# EAGLE design ethernet_switch (EAGLE 6.3)
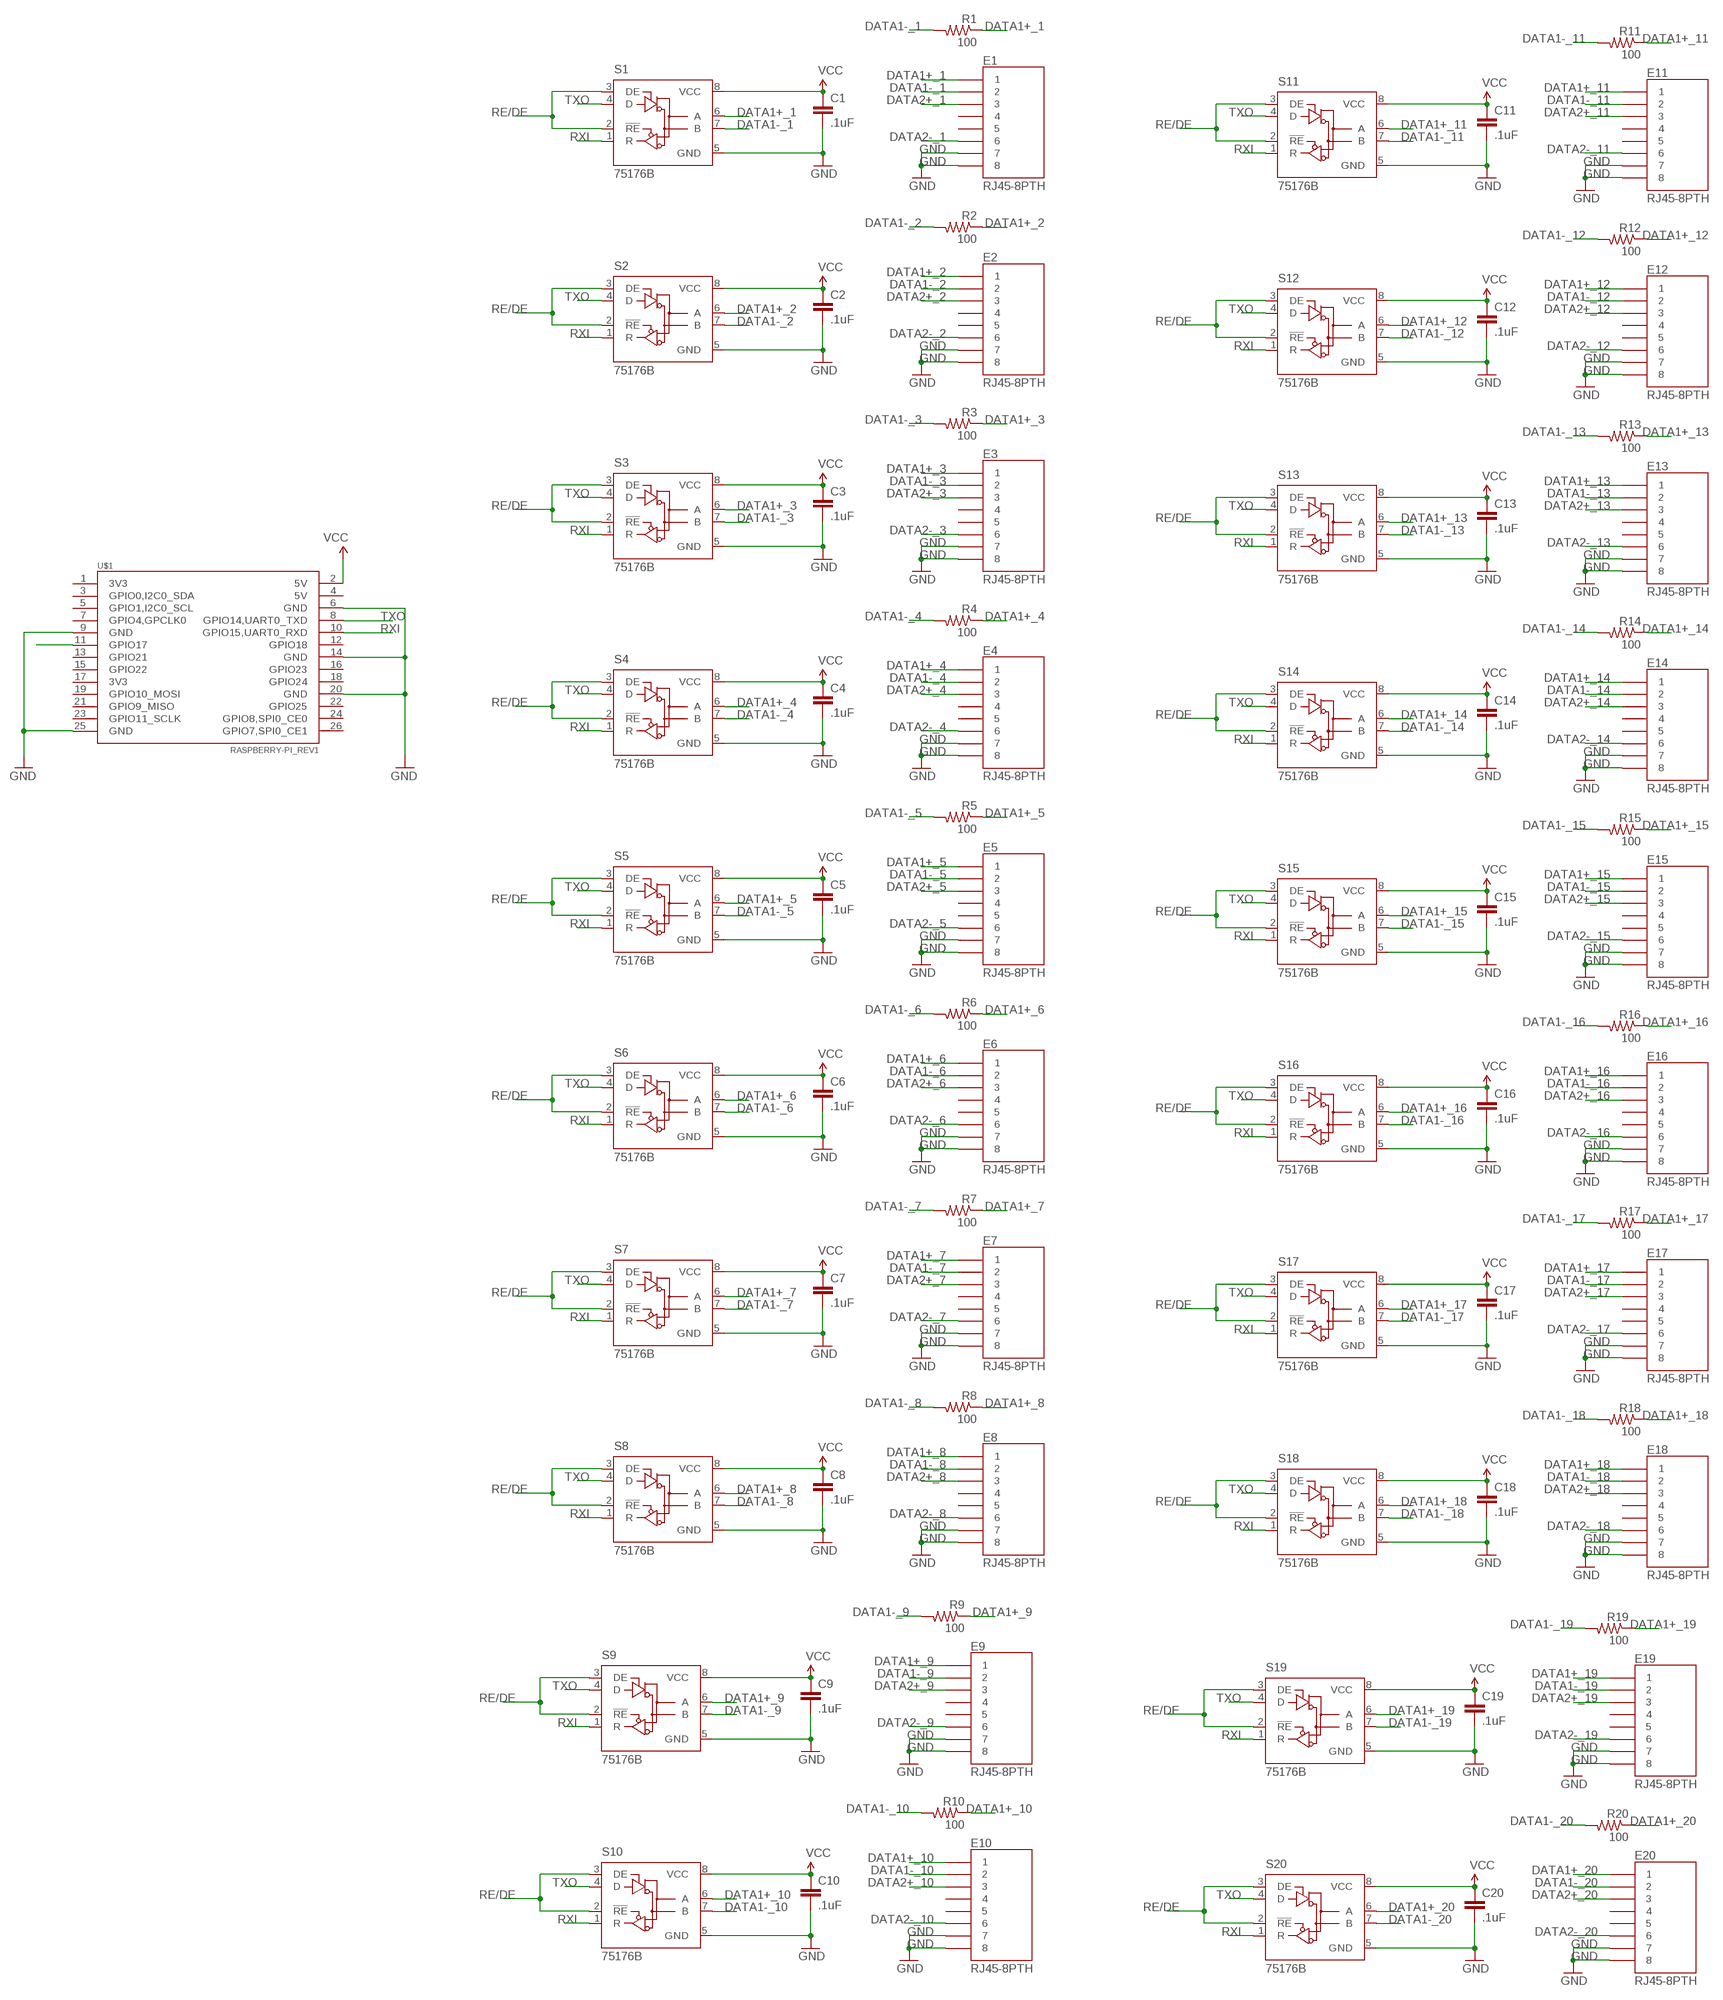
[diagram p0: schematic, sheet 1]

## Parts
C1  .1uF  CAP0402-CAP  [0402-CAP]
C2  .1uF  CAP0402-CAP  [0402-CAP]
C3  .1uF  CAP0402-CAP  [0402-CAP]
C4  .1uF  CAP0402-CAP  [0402-CAP]
C5  .1uF  CAP0402-CAP  [0402-CAP]
C6  .1uF  CAP0402-CAP  [0402-CAP]
C7  .1uF  CAP0402-CAP  [0402-CAP]
C8  .1uF  CAP0402-CAP  [0402-CAP]
C9  .1uF  CAP0402-CAP  [0402-CAP]
C10  .1uF  CAP0402-CAP  [0402-CAP]
C11  .1uF  CAP0402-CAP  [0402-CAP]
C12  .1uF  CAP0402-CAP  [0402-CAP]
C13  .1uF  CAP0402-CAP  [0402-CAP]
C14  .1uF  CAP0402-CAP  [0402-CAP]
C15  .1uF  CAP0402-CAP  [0402-CAP]
C16  .1uF  CAP0402-CAP  [0402-CAP]
C17  .1uF  CAP0402-CAP  [0402-CAP]
C18  .1uF  CAP0402-CAP  [0402-CAP]
C19  .1uF  CAP0402-CAP  [0402-CAP]
C20  .1uF  CAP0402-CAP  [0402-CAP]
E1  RJ45-8PTH  [RJ45-8]
E2  RJ45-8PTH  [RJ45-8]
E3  RJ45-8PTH  [RJ45-8]
E4  RJ45-8PTH  [RJ45-8]
E5  RJ45-8PTH  [RJ45-8]
E6  RJ45-8PTH  [RJ45-8]
E7  RJ45-8PTH  [RJ45-8]
E8  RJ45-8PTH  [RJ45-8]
E9  RJ45-8PTH  [RJ45-8]
E10  RJ45-8PTH  [RJ45-8]
E11  RJ45-8PTH  [RJ45-8]
E12  RJ45-8PTH  [RJ45-8]
E13  RJ45-8PTH  [RJ45-8]
E14  RJ45-8PTH  [RJ45-8]
E15  RJ45-8PTH  [RJ45-8]
E16  RJ45-8PTH  [RJ45-8]
E17  RJ45-8PTH  [RJ45-8]
E18  RJ45-8PTH  [RJ45-8]
E19  RJ45-8PTH  [RJ45-8]
E20  RJ45-8PTH  [RJ45-8]
R1  100  RESISTOR1206  [1206]
R2  100  RESISTOR1206  [1206]
R3  100  RESISTOR1206  [1206]
R4  100  RESISTOR1206  [1206]
R5  100  RESISTOR1206  [1206]
R6  100  RESISTOR1206  [1206]
R7  100  RESISTOR1206  [1206]
R8  100  RESISTOR1206  [1206]
R9  100  RESISTOR1206  [1206]
R10  100  RESISTOR1206  [1206]
R11  100  RESISTOR1206  [1206]
R12  100  RESISTOR1206  [1206]
R13  100  RESISTOR1206  [1206]
R14  100  RESISTOR1206  [1206]
R15  100  RESISTOR1206  [1206]
R16  100  RESISTOR1206  [1206]
R17  100  RESISTOR1206  [1206]
R18  100  RESISTOR1206  [1206]
R19  100  RESISTOR1206  [1206]
R20  100  RESISTOR1206  [1206]
S1  75176B  [D_R-PDSO-G8]
S2  75176B  [D_R-PDSO-G8]
S3  75176B  [D_R-PDSO-G8]
S4  75176B  [D_R-PDSO-G8]
S5  75176B  [D_R-PDSO-G8]
S6  75176B  [D_R-PDSO-G8]
S7  75176B  [D_R-PDSO-G8]
S8  75176B  [D_R-PDSO-G8]
S9  75176B  [D_R-PDSO-G8]
S10  75176B  [D_R-PDSO-G8]
S11  75176B  [D_R-PDSO-G8]
S12  75176B  [D_R-PDSO-G8]
S13  75176B  [D_R-PDSO-G8]
S14  75176B  [D_R-PDSO-G8]
S15  75176B  [D_R-PDSO-G8]
S16  75176B  [D_R-PDSO-G8]
S17  75176B  [D_R-PDSO-G8]
S18  75176B  [D_R-PDSO-G8]
S19  75176B  [D_R-PDSO-G8]
S20  75176B  [D_R-PDSO-G8]
U$1  RASPBERRY-PI_REV1  [RASPBERRY-PI_REV1]

## Nets
DATA1+_1: E1.1 R1.1 S1.6(A)
DATA1+_2: E2.1 R2.1 S2.6(A)
DATA1+_3: E3.1 R3.1 S3.6(A)
DATA1+_4: E4.1 R4.1 S4.6(A)
DATA1+_5: E5.1 R5.1 S5.6(A)
DATA1+_6: E6.1 R6.1 S6.6(A)
DATA1+_7: E7.1 R7.1 S7.6(A)
DATA1+_8: E8.1 R8.1 S8.6(A)
DATA1+_9: E9.1 R9.1 S9.6(A)
DATA1+_10: E10.1 R10.1 S10.6(A)
DATA1+_11: E11.1 R11.1 S11.6(A)
DATA1+_12: E12.1 R12.1 S12.6(A)
DATA1+_13: E13.1 R13.1 S13.6(A)
DATA1+_14: E14.1 R14.1 S14.6(A)
DATA1+_15: E15.1 R15.1 S15.6(A)
DATA1+_16: E16.1 R16.1 S16.6(A)
DATA1+_17: E17.1 R17.1 S17.6(A)
DATA1+_18: E18.1 R18.1 S18.6(A)
DATA1+_19: E19.1 R19.1 S19.6(A)
DATA1+_20: E20.1 R20.1 S20.6(A)
DATA1-_1: E1.2 R1.2 S1.7(B)
DATA1-_2: E2.2 R2.2 S2.7(B)
DATA1-_3: E3.2 R3.2 S3.7(B)
DATA1-_4: E4.2 R4.2 S4.7(B)
DATA1-_5: E5.2 R5.2 S5.7(B)
DATA1-_6: E6.2 R6.2 S6.7(B)
DATA1-_7: E7.2 R7.2 S7.7(B)
DATA1-_8: E8.2 R8.2 S8.7(B)
DATA1-_9: E9.2 R9.2 S9.7(B)
DATA1-_10: E10.2 R10.2 S10.7(B)
DATA1-_11: E11.2 R11.2 S11.7(B)
DATA1-_12: E12.2 R12.2 S12.7(B)
DATA1-_13: E13.2 R13.2 S13.7(B)
DATA1-_14: E14.2 R14.2 S14.7(B)
DATA1-_15: E15.2 R15.2 S15.7(B)
DATA1-_16: E16.2 R16.2 S16.7(B)
DATA1-_17: E17.2 R17.2 S17.7(B)
DATA1-_18: E18.2 R18.2 S18.7(B)
DATA1-_19: E19.2 R19.2 S19.7(B)
DATA1-_20: E20.2 R20.2 S20.7(B)
DATA2+_1: E1.3
DATA2+_2: E2.3
DATA2+_3: E3.3
DATA2+_4: E4.3
DATA2+_5: E5.3
DATA2+_6: E6.3
DATA2+_7: E7.3
DATA2+_8: E8.3
DATA2+_9: E9.3
DATA2+_10: E10.3
DATA2+_11: E11.3
DATA2+_12: E12.3
DATA2+_13: E13.3
DATA2+_14: E14.3
DATA2+_15: E15.3
DATA2+_16: E16.3
DATA2+_17: E17.3
DATA2+_18: E18.3
DATA2+_19: E19.3
DATA2+_20: E20.3
DATA2-_1: E1.6
DATA2-_2: E2.6
DATA2-_3: E3.6
DATA2-_4: E4.6
DATA2-_5: E5.6
DATA2-_6: E6.6
DATA2-_7: E7.6
DATA2-_8: E8.6
DATA2-_9: E9.6
DATA2-_10: E10.6
DATA2-_11: E11.6
DATA2-_12: E12.6
DATA2-_13: E13.6
DATA2-_14: E14.6
DATA2-_15: E15.6
DATA2-_16: E16.6
DATA2-_17: E17.6
DATA2-_18: E18.6
DATA2-_19: E19.6
DATA2-_20: E20.6
GND: C1.2 C2.2 C3.2 C4.2 C5.2 C6.2 C7.2 C8.2 C9.2 C10.2 C11.2 C12.2 C13.2 C14.2 C15.2 C16.2 C17.2 C18.2 C19.2 C20.2 E1.7 E1.8 E2.7 E2.8 E3.7 E3.8 E4.7 E4.8 E5.7 E5.8 E6.7 E6.8 E7.7 E7.8 E8.7 E8.8 E9.7 E9.8 E10.7 E10.8 E11.7 E11.8 E12.7 E12.8 E13.7 E13.8 E14.7 E14.8 E15.7 E15.8 E16.7 E16.8 E17.7 E17.8 E18.7 E18.8 E19.7 E19.8 E20.7 E20.8 S1.5(GND) S2.5(GND) S3.5(GND) S4.5(GND) S5.5(GND) S6.5(GND) S7.5(GND) S8.5(GND) S9.5(GND) S10.5(GND) S11.5(GND) S12.5(GND) S13.5(GND) S14.5(GND) S15.5(GND) S16.5(GND) S17.5(GND) S18.5(GND) S19.5(GND) S20.5(GND) U$1.6(GND) U$1.9(GND) U$1.14(GND) U$1.20(GND) U$1.25(GND)
RE/DE: S1.2(!RE) S1.3(DE) S2.2(!RE) S2.3(DE) S3.2(!RE) S3.3(DE) S4.2(!RE) S4.3(DE) S5.2(!RE) S5.3(DE) S6.2(!RE) S6.3(DE) S7.2(!RE) S7.3(DE) S8.2(!RE) S8.3(DE) S9.2(!RE) S9.3(DE) S10.2(!RE) S10.3(DE) S11.2(!RE) S11.3(DE) S12.2(!RE) S12.3(DE) S13.2(!RE) S13.3(DE) S14.2(!RE) S14.3(DE) S15.2(!RE) S15.3(DE) S16.2(!RE) S16.3(DE) S17.2(!RE) S17.3(DE) S18.2(!RE) S18.3(DE) S19.2(!RE) S19.3(DE) S20.2(!RE) S20.3(DE) U$1.11(GPIO17)
RXI: S1.1(R) S2.1(R) S3.1(R) S4.1(R) S5.1(R) S6.1(R) S7.1(R) S8.1(R) S9.1(R) S10.1(R) S11.1(R) S12.1(R) S13.1(R) S14.1(R) S15.1(R) S16.1(R) S17.1(R) S18.1(R) S19.1(R) S20.1(R) U$1.10(GPIO15,UART0_RXD)
TXO: S1.4(D) S2.4(D) S3.4(D) S4.4(D) S5.4(D) S6.4(D) S7.4(D) S8.4(D) S9.4(D) S10.4(D) S11.4(D) S12.4(D) S13.4(D) S14.4(D) S15.4(D) S16.4(D) S17.4(D) S18.4(D) S19.4(D) S20.4(D) U$1.8(GPIO14,UART0_TXD)
VCC: C1.1 C2.1 C3.1 C4.1 C5.1 C6.1 C7.1 C8.1 C9.1 C10.1 C11.1 C12.1 C13.1 C14.1 C15.1 C16.1 C17.1 C18.1 C19.1 C20.1 S1.8(VCC) S2.8(VCC) S3.8(VCC) S4.8(VCC) S5.8(VCC) S6.8(VCC) S7.8(VCC) S8.8(VCC) S9.8(VCC) S10.8(VCC) S11.8(VCC) S12.8(VCC) S13.8(VCC) S14.8(VCC) S15.8(VCC) S16.8(VCC) S17.8(VCC) S18.8(VCC) S19.8(VCC) S20.8(VCC) U$1.2(5V)
Unconnected: E1.4 E1.5 E2.4 E2.5 E3.4 E3.5 E4.4 E4.5 E5.4 E5.5 E6.4 E6.5 E7.4 E7.5 E8.4 E8.5 E9.4 E9.5 E10.4 E10.5 E11.4 E11.5 E12.4 E12.5 E13.4 E13.5 E14.4 E14.5 E15.4 E15.5 E16.4 E16.5 E17.4 E17.5 E18.4 E18.5 E19.4 E19.5 E20.4 E20.5 U$1.1(3V3) U$1.3(GPIO0,I2C0_SDA) U$1.4(5V) U$1.5(GPIO1,I2C0_SCL) U$1.7(GPIO4,GPCLK0) U$1.12(GPIO18) U$1.13(GPIO21) U$1.15(GPIO22) U$1.16(GPIO23) U$1.17(3V3) U$1.18(GPIO24) U$1.19(GPIO10_MOSI) U$1.21(GPIO9_MISO) U$1.22(GPIO25) U$1.23(GPIO11_SCLK) U$1.24(GPIO8,SPI0_CE0) U$1.26(GPIO7,SPI0_CE1)

## Library data of the parts
C1-C20 = SparkFun-Capacitors:CAP: Capacitor Standard 0603 ceramic capacitor, and 0.1" leaded capacitor.
E1-E20 = SparkFun-Connectors:RJ45-8: RJ45 Jack Simple RJ45, 8-pin connection - connector for common Cat5, Cat5e, and Cat6 Ethernet cables. Footprint not yet proven in production. Connector sku is PRT-00643; Breakout PCB sku is BOB-00716.
R1-R20 = SparkFun-Passives:RESISTOR: Resistor Basic schematic elements and footprints for 0603, 1206, and PTH resistors.
S1-S20 = 751xx:75176B: 75176B
U$1 = RaspberryPi:RASPBERRY-PI_REV1: Raspberry Pi Board <http://www.raspberrypi.org/> Jacques Lagnel V1.0 (beta) 2012 Mateusz Bawaj V1.1 (beta) 2012 Board dimension: Forum 3D model <http://www.raspberrypi.org/forum/general-discussion/mechanical-profile-3d-models?value=3d%20model&type=1&include=1&search=1&ret=all> The GPIO Connector (P1): http://elinux.org/RPi_Low-level_peripherals

## Net classes
1 vcc: width 0.254 mm

## Board
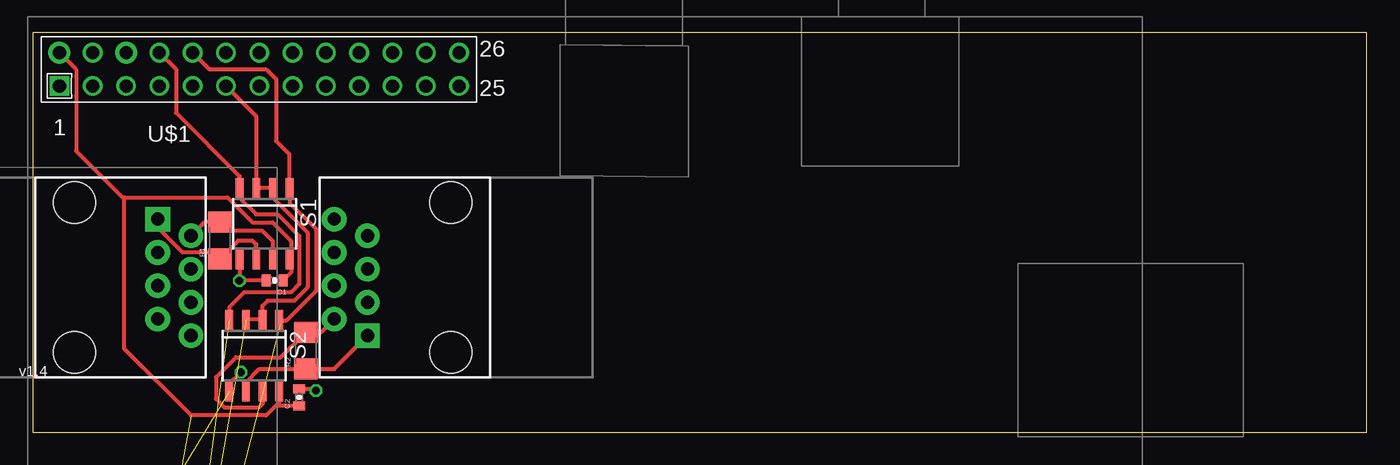
[diagram p1: board, top side]
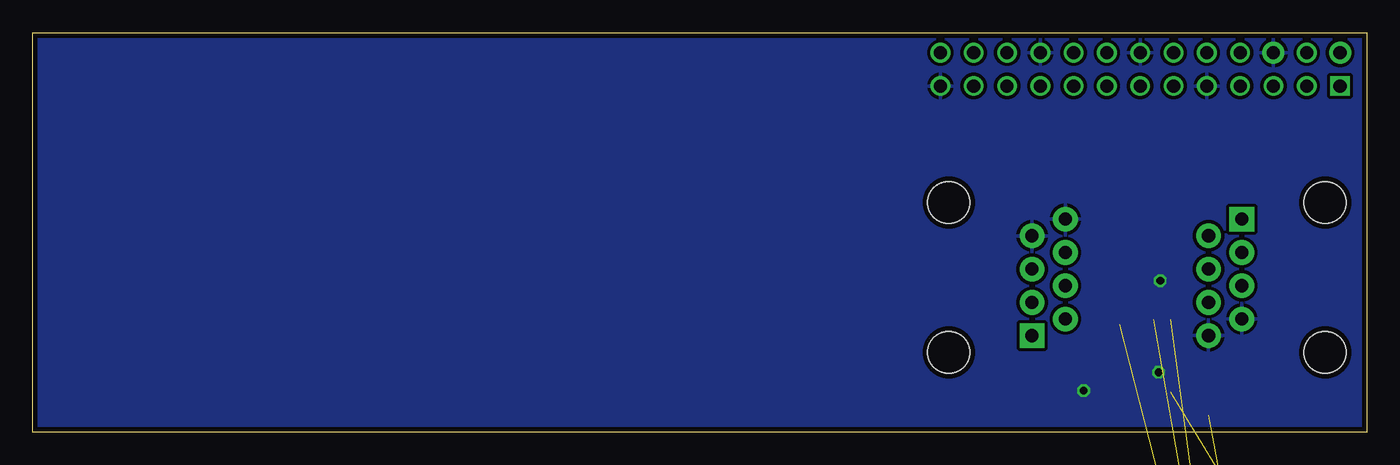
[diagram p2: board, bottom side, seen from below]

Size 101.73 x 30.48 mm. Coordinates in mm from the lower left corner, seen from the top.
Outline: 0,0 101.73,0 101.73,30.48 0,30.48 0,0
Copper layers (1*16): Top 0.0356mm / dielectric 1.5011mm / Bottom 0.0356mm
Design rules "LaenPCBOrder *": minimum track width 6mil, minimum drill 13mil, track to track 10mil, track to pad 6mil, pad to pad 6mil, via to via 6mil, smd to smd 6mil, copper to edge 15mil, drill to drill 6mil, minimum pad ring 7mil, minimum via ring 7mil, stop-mask expansion 4mil, vias tented up to drill 0mil, thermal gap 10mil

### Footprints (pad centres in the part's own frame; a part is rotated, then mirrored left to right if it is on the bottom)
0402-CAP = smd 0.7 x 0.9: 1 -0.65,0; 2 0.65,0
RJ45-8 = drill 1 pad 1.88 square: 1 -4.445,6.35 | drill 1 pad 1.88: 2 -3.175,8.89; 3 -1.905,6.35; 4 -0.635,8.89; 5 0.635,6.35; 6 1.905,8.89; 7 3.175,6.35; 8 4.445,8.89 | hole 3.2: -5.715,0; 5.715,0
1206 = smd 1.6 x 1.8: 1 -1.4,0; 2 1.4,0
D_R-PDSO-G8 = smd 0.6 x 1.5: 1 -1.905,-2.75; 2 -0.635,-2.75; 3 0.635,-2.75; 4 1.905,-2.75; 5 1.905,2.75; 6 0.635,2.75; 7 -0.635,2.75; 8 -1.905,2.75
RASPBERRY-PI_REV1 = drill 1 square: 1 -41.91,21.59 | drill 1 pad 1.676: 2 -41.91,24.13; 6 -36.83,24.13 | drill 1: 3 -39.37,21.59; 4 -39.37,24.13; 5 -36.83,21.59; 7 -34.29,21.59; 8 -34.29,24.13; 9 -31.75,21.59; 10 -31.75,24.13; 11 -29.21,21.59; 12 -29.21,24.13; 13 -26.67,21.59; 14 -26.67,24.13; 15 -24.13,21.59; 16 -24.13,24.13; 17 -21.59,21.59; 18 -21.59,24.13; 19 -19.05,21.59; 20 -19.05,24.13; 21 -16.51,21.59; 22 -16.51,24.13; 23 -13.97,21.59; 24 -13.97,24.13; 25 -11.43,21.59; 26 -11.43,24.13

### Placement (x,y rotation side)
C1  18.45,11.59 180 top
C2  20.32,2.67 90 top
C3  5.33,-68.96 0 top  (outside the outline)
C4  8.51,-68.96 0 top  (outside the outline)
C5  -3.56,-129.54 0 top  (outside the outline)
C6  -0.38,-129.54 0 top  (outside the outline)
C7  2.79,-129.54 0 top  (outside the outline)
C8  5.97,-129.54 0 top  (outside the outline)
C9  5.33,-175.39 0 top  (outside the outline)
C10  8.51,-175.39 0 top  (outside the outline)
C11  37.08,-257.05 0 top  (outside the outline)
C12  40.26,-257.05 0 top  (outside the outline)
C13  43.43,-257.05 0 top  (outside the outline)
C14  46.61,-257.05 0 top  (outside the outline)
C15  -13.72,-260.73 0 top  (outside the outline)
C16  -10.54,-260.73 0 top  (outside the outline)
C17  -7.37,-260.73 0 top  (outside the outline)
C18  -4.19,-260.73 0 top  (outside the outline)
C19  -1.02,-260.73 0 top  (outside the outline)
C20  2.16,-260.73 0 top  (outside the outline)
E1  3.17,11.81 270 top
E2  31.88,11.81 90 top
E3  -7.62,-35.69 0 top  (outside the outline)
E4  -7.62,-56.77 0 top  (outside the outline)
E5  -7.62,-87 0 top  (outside the outline)
E6  7.87,-87 0 top  (outside the outline)
E7  -7.62,-108.08 0 top  (outside the outline)
E8  7.87,-108.08 0 top  (outside the outline)
E9  -7.62,-142.11 0 top  (outside the outline)
E10  -7.62,-163.19 0 top  (outside the outline)
E11  -7.62,-193.42 0 top  (outside the outline)
E12  7.87,-193.42 0 top  (outside the outline)
E13  23.37,-193.42 0 top  (outside the outline)
E14  38.86,-193.42 0 top  (outside the outline)
E15  -7.62,-214.5 0 top  (outside the outline)
E16  7.87,-214.5 0 top  (outside the outline)
E17  23.37,-214.5 0 top  (outside the outline)
E18  38.86,-214.5 0 top  (outside the outline)
E19  -7.62,-235.59 0 top  (outside the outline)
E20  7.87,-235.59 0 top  (outside the outline)
R1  14.27,14.62 90 top
R2  20.83,6.22 90 top
R3  -3.94,-69.47 0 top  (outside the outline)
R4  1.14,-69.47 0 top  (outside the outline)
R5  13.84,-120.78 0 top  (outside the outline)
R6  18.92,-120.78 0 top  (outside the outline)
R7  -12.83,-129.92 0 top  (outside the outline)
R8  -7.75,-129.92 0 top  (outside the outline)
R9  -3.94,-175.9 0 top  (outside the outline)
R10  1.14,-175.9 0 top  (outside the outline)
R11  -12.83,-257.43 0 top  (outside the outline)
R12  -7.75,-257.43 0 top  (outside the outline)
R13  -2.67,-257.43 0 top  (outside the outline)
R14  2.41,-257.43 0 top  (outside the outline)
R15  7.49,-257.43 0 top  (outside the outline)
R16  12.57,-257.43 0 top  (outside the outline)
R17  17.65,-257.43 0 top  (outside the outline)
R18  22.73,-257.43 0 top  (outside the outline)
R19  27.81,-257.43 0 top  (outside the outline)
R20  32.89,-257.43 0 top  (outside the outline)
S1  17.69,15.9 180 top
S2  16.89,5.84 180 top
S3  4.57,-52.2 0 top  (outside the outline)
S4  -10.92,-73.28 0 top  (outside the outline)
S5  20.07,-103.5 0 top  (outside the outline)
S6  -10.92,-124.59 0 top  (outside the outline)
S7  -2.03,-124.59 0 top  (outside the outline)
S8  6.86,-124.59 0 top  (outside the outline)
S9  4.57,-158.62 0 top  (outside the outline)
S10  -10.92,-179.71 0 top  (outside the outline)
S11  20.07,-231.01 0 top  (outside the outline)
S12  28.96,-231.01 0 top  (outside the outline)
S13  37.85,-231.01 0 top  (outside the outline)
S14  -10.92,-252.09 0 top  (outside the outline)
S15  -2.03,-252.09 0 top  (outside the outline)
S16  6.86,-252.09 0 top  (outside the outline)
S17  15.75,-252.09 0 top  (outside the outline)
S18  24.64,-252.09 0 top  (outside the outline)
S19  33.53,-252.09 0 top  (outside the outline)
S20  42.42,-252.09 0 top  (outside the outline)
U$1  43.94,4.83 0 top

### Tracks (layer width: path | path; a pad name or v marks a point on that pad's centre or on a via)
DATA1+_1
  Top 0.305: 17.04,13.14 17.04,13.34 | 17.04,13.34 17.04,14.33 16.76,14.61 15.66,14.61 R1.1 13.78,13.72 11.43,13.72 9.53,15.62 E1.1 | S1.6 17.05,13.32 17.04,13.34
DATA1+_2
  Top 0.305: S2.6 16.26,3.81 17.27,4.83 R2.1 22.98,4.82 E2.1
DATA1+_3  (2 unrouted)
DATA1+_4  (2 unrouted)
DATA1+_5  (2 unrouted)
DATA1+_6  (2 unrouted)
DATA1+_7  (2 unrouted)
DATA1+_8  (2 unrouted)
DATA1+_9  (2 unrouted)
DATA1+_10  (2 unrouted)
DATA1+_11  (2 unrouted)
DATA1+_12  (2 unrouted)
DATA1+_13  (2 unrouted)
DATA1+_14  (2 unrouted)
DATA1+_15  (2 unrouted)
DATA1+_16  (2 unrouted)
DATA1+_17  (2 unrouted)
DATA1+_18  (2 unrouted)
DATA1+_19  (2 unrouted)
DATA1+_20  (2 unrouted)
DATA1-_1
  Top 0.305: S1.7 18.29,13.19 18.29,14.61 17.53,15.37 14.93,15.37 R1.2 13.1,16.02 E1.2
DATA1-_2
  Top 0.305: E2.2 21.97,7.62 R2.2 18.92,5.71 15.49,5.71 13.97,4.19 13.97,2.54 14.61,1.91 17.27,1.91 17.53,2.16 S2.7
DATA1-_3  (2 unrouted)
DATA1-_4  (2 unrouted)
DATA1-_5  (2 unrouted)
DATA1-_6  (2 unrouted)
DATA1-_7  (2 unrouted)
DATA1-_8  (2 unrouted)
DATA1-_9  (2 unrouted)
DATA1-_10  (2 unrouted)
DATA1-_11  (2 unrouted)
DATA1-_12  (2 unrouted)
DATA1-_13  (2 unrouted)
DATA1-_14  (2 unrouted)
DATA1-_15  (2 unrouted)
DATA1-_16  (2 unrouted)
DATA1-_17  (2 unrouted)
DATA1-_18  (2 unrouted)
DATA1-_19  (2 unrouted)
DATA1-_20  (2 unrouted)
GND  (via drill 0.6)  (72 unrouted)
  Top 0.305: S1.5 15.79,11.59 v15.75,11.56 15.78,11.59 C1.2 | S2.5 14.99,3.68 v15.88,4.57 | C2.2 21.45,3.32 v21.59,3.17
  pour Bottom: 0,0 0,30.48 101.73,30.48 101.73,0
RE/DE  (36 unrouted)
  Top 0.305: S2.3 S2.2 17.53,9.65 17.91,10.03 19.94,10.03 20.95,11.05 20.95,15.24 18.29,17.91 18.29,18.62 S1.2 S1.3 17.02,18.69 17.02,24.13 U$1.11
RXI  (18 unrouted)
  Top 0.305: 19.68,19.18 19.68,18.74 S1.1 | S1.1 19.56,18.69 19.56,21.21 18.54,22.23 18.54,26.92 17.78,27.69 13.46,27.69 U$1.10 | S1.1 19.59,17.49 21.59,15.49 21.59,10.79 19.3,8.51 18.88,8.51 S2.1 18.88,8.21
TXO  (18 unrouted)
  Top 0.305: S2.4 14.99,9.53 16.13,10.67 19.68,10.67 20.32,11.3 20.32,14.99 18.67,16.64 17.02,16.64 15.79,17.87 S1.4 15.79,19.52 10.92,24.38 10.92,27.69 U$1.8
VCC  (36 unrouted)
  Top 0.305: 6.98,17.91 6.86,17.91 3.3,21.46 3.3,27.69 U$1.2 | 6.98,17.91 14.86,17.91 16.76,16 18.29,16 19.68,14.61 19.68,13.24 S1.8 19.69,13.25 19.69,12.18 C1.1 | S2.8 18.8,2.29 18.53,2.02 | 18.53,2.02 17.78,1.27 12.07,1.27 6.98,6.35 6.98,17.91 | C2.1 18.53,2.02

### Text on the board
tPlace: v1.4